# EAGLE schematic Feather10DOF (EAGLE 7.5.0)
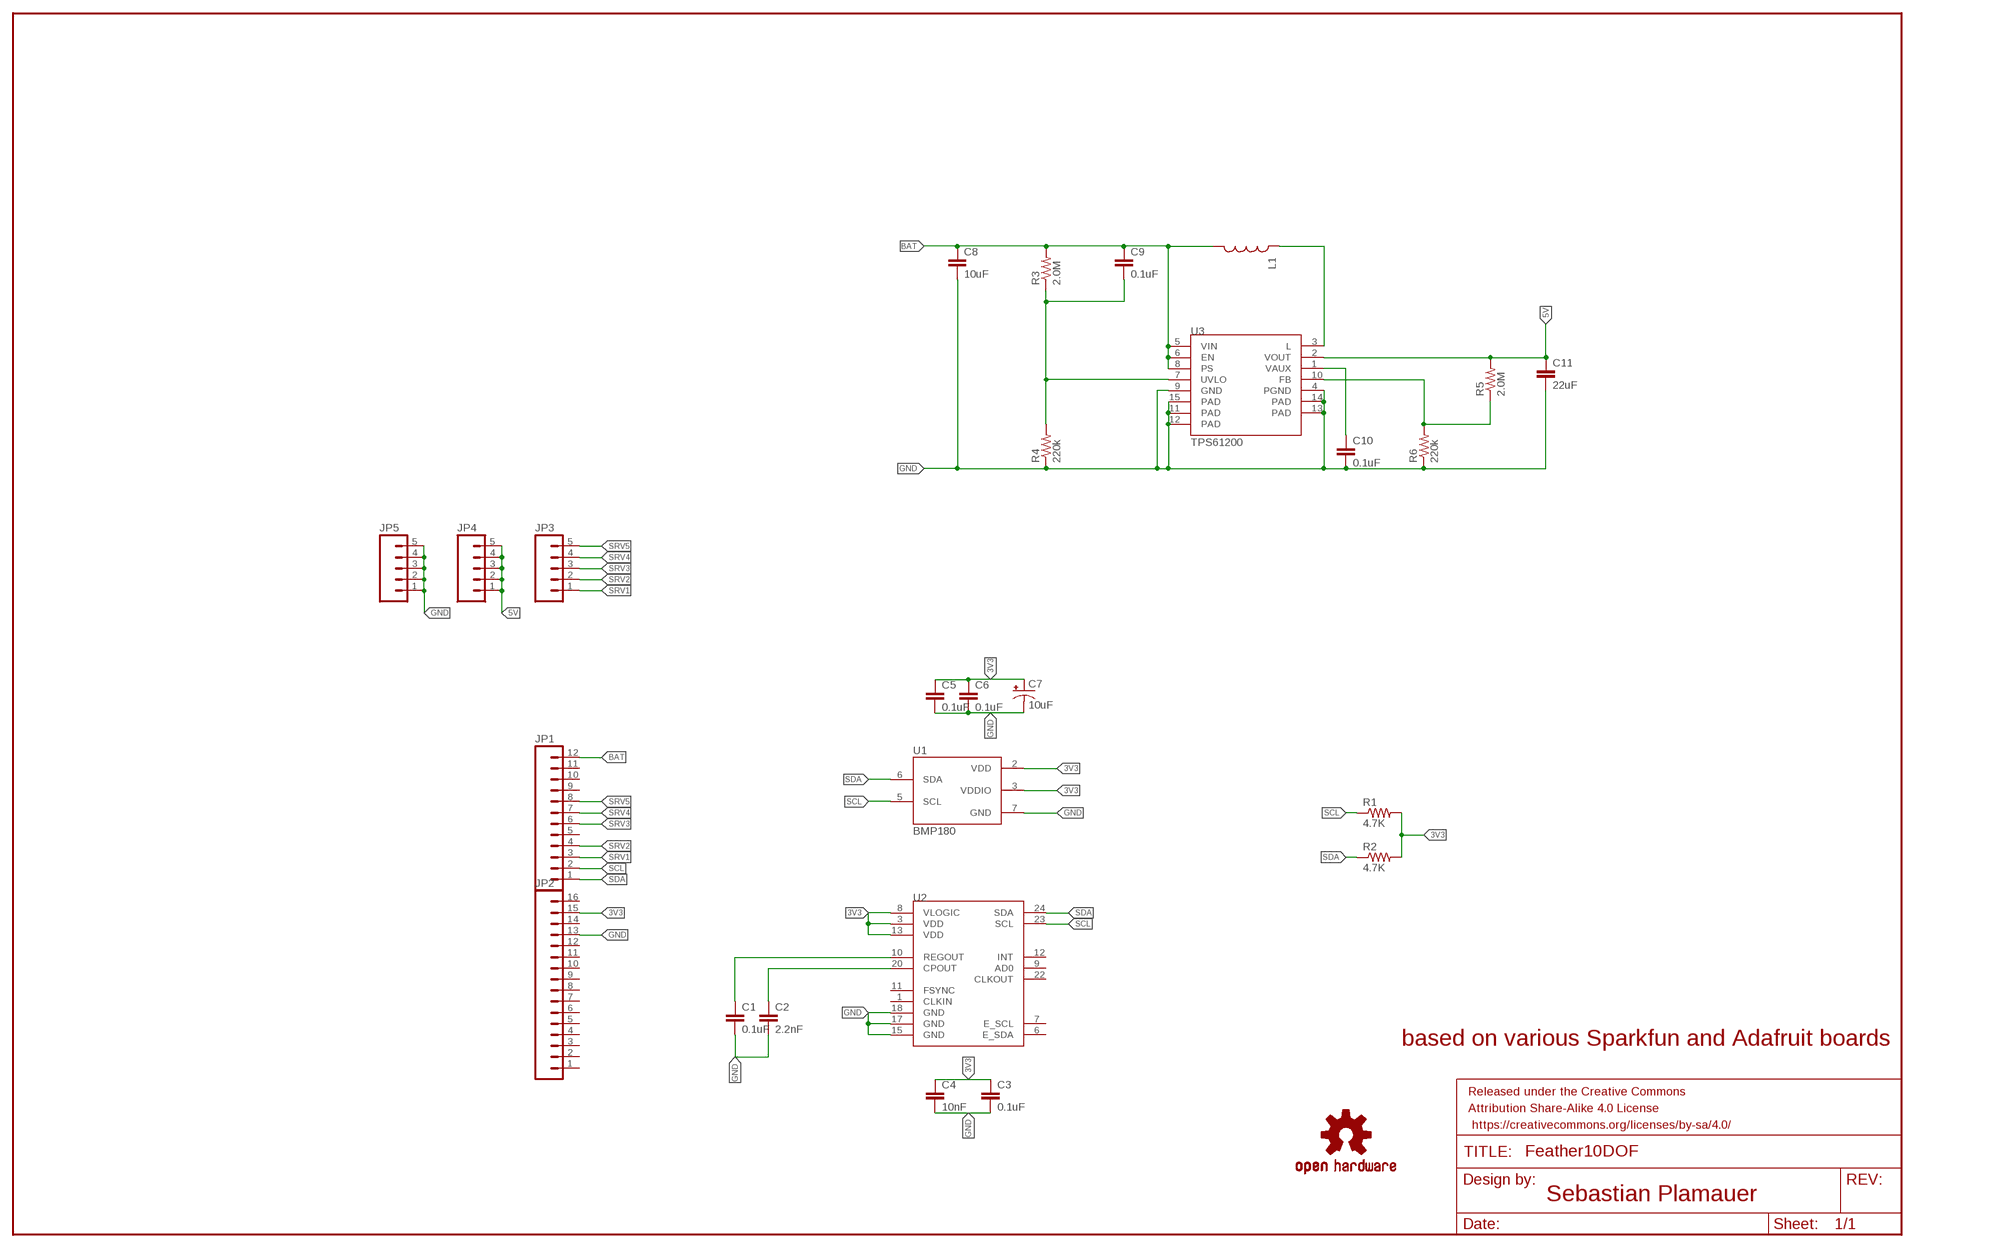
[diagram p0: schematic, sheet 1]

## Parts
C1  0.1uF  0.1UF-25V(+80/-20%)(0603)  [0603-CAP]
C2  2.2nF  2.2NF/2200PF-50V-10%(0603)  [0603-CAP]
C3  0.1uF  0.1UF-25V(+80/-20%)(0603)  [0603-CAP]
C4  10nF  10NF/10000PF-50V-10%(0603)  [0603-CAP]
C5  0.1uF  0.1UF-25V(+80/-20%)(0603)  [0603-CAP]
C6  0.1uF  0.1UF-25V(+80/-20%)(0603)  [0603-CAP]
C7  10uF  10UF-6.3V-20%(0603)(TANT)"  [0603-POL]
C8  10uF  10UF-6.3V-20%(0603)  [0603-CAP]
C9  0.1uF  0.1UF-25V(+80/-20%)(0603)  [0603-CAP]
C10  0.1uF  0.1UF-25V(+80/-20%)(0603)  [0603-CAP]
C11  22uF  22UF-6.3V-20%(0805)  [0805]
FRAME1  FRAME-LEDGER  [CREATIVE_COMMONS]
JP1  M12PTH  [1X12]
JP2  M16PTH  [1X16]
JP3  M05PTH  [1X05]
JP4  M05PTH  [1X05]
JP5  M05PTH  [1X05]
L1  INDUCTOR1007  [1007]
LOGO1  OSHW-LOGOL  [OSHW-LOGO-L]
R1  4.7K  4.7KOHM-1/10W-1%(0603)  [0603-RES]
R2  4.7K  4.7KOHM-1/10W-1%(0603)  [0603-RES]
R3  2.0M  2MOHMS-1/10W-1%(0603)  [0603-RES]
R4  220k  220KOHM1/10W1%(0603)  [0603-RES]
R5  2.0M  2MOHMS-1/10W-1%(0603)  [0603-RES]
R6  220k  220KOHM1/10W1%(0603)  [0603-RES]
U1  BMP180  [BMP180]
U2  MPU-9150QFN-24-NP  [QFN-24-NP]
U3  TPS61200  [QFN-10_PAD]

## Nets
3V3: C3.1 C4.1 C5.1 C6.1 C7.A(+) JP2.15 R1.2 R2.2 U1.2(VDD) U1.3(VDDIO) U2.3(VDD) U2.8(VLOGIC) U2.13(VDD)
5V: C11.1 JP4.1 JP4.2 JP4.3 JP4.4 JP4.5 R5.2 U3.2(VOUT)
BAT: C8.1 C9.1 JP1.12 L1.2 R3.2 U3.5(VIN) U3.6(EN) U3.8(PS)
GND: C1.2 C2.2 C3.2 C4.2 C5.2 C6.2 C7.K(-) C8.2 C10.2 C11.2 JP2.13 JP5.1 JP5.2 JP5.3 JP5.4 JP5.5 R4.1 R6.1 U1.7(GND) U2.15(GND) U2.17(GND) U2.18(GND) U3.4(PGND) U3.9(GND) U3.11(PAD) U3.12(PAD) U3.13(PAD) U3.14(PAD) U3.15(PAD)
N$1: C2.1 U2.20(CPOUT)
N$2: C1.1 U2.10(REGOUT)
N$4: R5.1 R6.2 U3.10(FB)
N$5: C9.2 R3.1 R4.2 U3.7(UVLO)
N$8: L1.1 U3.3(L)
N$10: C10.1 U3.1(VAUX)
SCL: JP1.2 R1.1 U1.5(SCL) U2.23(SCL)
SDA: JP1.1 R2.1 U1.6(SDA) U2.24(SDA)
SRV1: JP1.3 JP3.1
SRV2: JP1.4 JP3.2
SRV3: JP1.6 JP3.3
SRV4: JP1.7 JP3.4
SRV5: JP1.8 JP3.5
Unconnected: JP1.5 JP1.9 JP1.10 JP1.11 JP2.1 JP2.2 JP2.3 JP2.4 JP2.5 JP2.6 JP2.7 JP2.8 JP2.9 JP2.10 JP2.11 JP2.12 JP2.14 JP2.16 U2.1(CLKIN) U2.6(E_SDA) U2.7(E_SCL) U2.9(AD0) U2.11(FSYNC) U2.12(INT) U2.22(CLKOUT)

## Notes on the sheet
- based on various Sparkfun and Adafruit boards
- Sebastian Plamauer

## Library data of the parts
C1 C3 C5 C6 C9 C10 = SparkFun-Capacitors:0.1UF-25V(+80/-20%)(0603): CAP-00810 Ceramic Standard decoupling cap; PROD_ID: CAP-00810
C2 = SparkFun-Capacitors:2.2NF/2200PF-50V-10%(0603): CAP-07877; PROD_ID: CAP-07877
C4 = SparkFun-Capacitors:10NF/10000PF-50V-10%(0603): CAP-00867; PROD_ID: CAP-00867
C7 = SparkFun-Capacitors:10UF-6.3V-20%(0603)(TANT); PROD_ID: CAP-13210
C8 = SparkFun-Capacitors:10UF-6.3V-20%(0603): CAP-11015; PROD_ID: CAP-11015
C11 = SparkFun-Capacitors:22UF-6.3V-20%(0805): CAP-08402 Ceramic; PROD_ID: CAP-08402
FRAME1 = SparkFun-Aesthetics:FRAME-LEDGER: Schematic Frame Standard 11x14 US Ledger frame
JP1 = SparkFun-Connectors:M12: Header 12 Standard 12-pin 0.1" header. Use with straight break away headers (SKU : PRT-00116), right angle break away headers (PRT-00553), swiss pins (PRT-00743), machine pins (PRT-00117), and female headers (PRT-00115).
JP2 = SparkFun-Connectors:M16: 1x16 .1" header
JP3-JP5 = SparkFun-Connectors:M05: Header 5 Standard 5-pin 0.1" header. Use with straight break away headers (SKU : PRT-00116), right angle break away headers (PRT-00553), swiss pins (PRT-00743), machine pins (PRT-00117), and female headers (PRT-00115). Molex polarized connector foot print use with SKU : PRT-08230 with associated crimp pins and housings.
L1 = SparkFun-Passives:INDUCTOR: Inductors Basic Inductor/Choke - 0603 and 1206. Footprints are not proven and vary greatly between part numbers. INDUCTOR POWER 3.3UH 4.0A SMD 0.197" L x 0.197" W x 0.177" H (5.00mm x 5.00mm x 4.50mm)
LOGO1 = SparkFun-Aesthetics:OSHW-LOGO: Open Source Hardware Logo This logo indicates the piece of hardware it is found on incorporates a OSHW license and/or adheres to the definition of open source hardware found here: http://freedomdefined.org/OSHW
R1 R2 = SparkFun-Resistors:4.7KOHM-1/10W-1%(0603): RES-07857; PROD_ID: RES-07857
R3 R5 = SparkFun-Resistors:2MOHMS-1/10W-1%(0603): RES-10054; PROD_ID: RES-10054
R4 R6 = SparkFun-Resistors:220KOHM1/10W1%(0603): RES-08969; PROD_ID: RES-08969
U1 = SparkFun-Sensors:BMP180: BOSCH BMP180 DIGITAL BAROMETRIC PRESSURE SENSOR Web page: http://www.bosch-sensortec.com/en/homepage/products_3/environmental_sensors_1/bmp180_1/bmp180 Datasheet: http://ae-bst.resource.bosch.com/media/products/dokumente/bmp180/BST-BMP180-DS000-09.pdf The BMP180 is the function compatible successor of the BMP085, a new generation of high precision digital pressure sensors for consumer applications. The ultra-low power, low voltage electronics of the BMP180 is optimized for use in mobile phones, PDAs, GPS navigation devices and outdoor equipment. With a low altitude noise of merely 0.25m at fast conversion time, the BMP180 offers superior performance. The I2C interface allows for easy system integration with a microcontroller. The BMP180 is based on piezo-resistive technology for EMC robustness, high accuracy and linearity as well as long term stability. Key features: - Temperature measurement included - I2C interface - Fully calibrated - Pb-free, halogen-free and RoHS compliant, - MSL 1 Basic specs: Pressure range: 300 to 1100hPa (+9000m to -500m relating to sea level) Supply voltage: 1.8 to 3.6V (VDD), 1.62V to 3.6V (VDDIO) Package: LGA package with metal lid Small footprint: 3.6mm x 3.8mm Super-flat: 0.93mm height Low power: 5μA at 1 sample / sec. in standard mode Low noise: 0.06hPa (0.5m) in ultra low power mode, 0.02hPa (0.17m) advanced resolution mode Typical applications: - Enhancement of GPS navigation (dead-reckoning, slope detection, etc.) - In- and out-door navigation - Leisure and sports - Weather forecast - Vertical velocity indication (rise/sink speed)
U2 = SparkFun-Sensors:MPU-9150: 9DOF (3mag, 3accel, 3rotat). I2C interface.
U3 = SparkFun-PowerIC:TPS61200: DC to DC Booster IC-10035; PROD_ID: IC-10035